# Altium schematic sheet AudioADCA.SchDoc
size A4
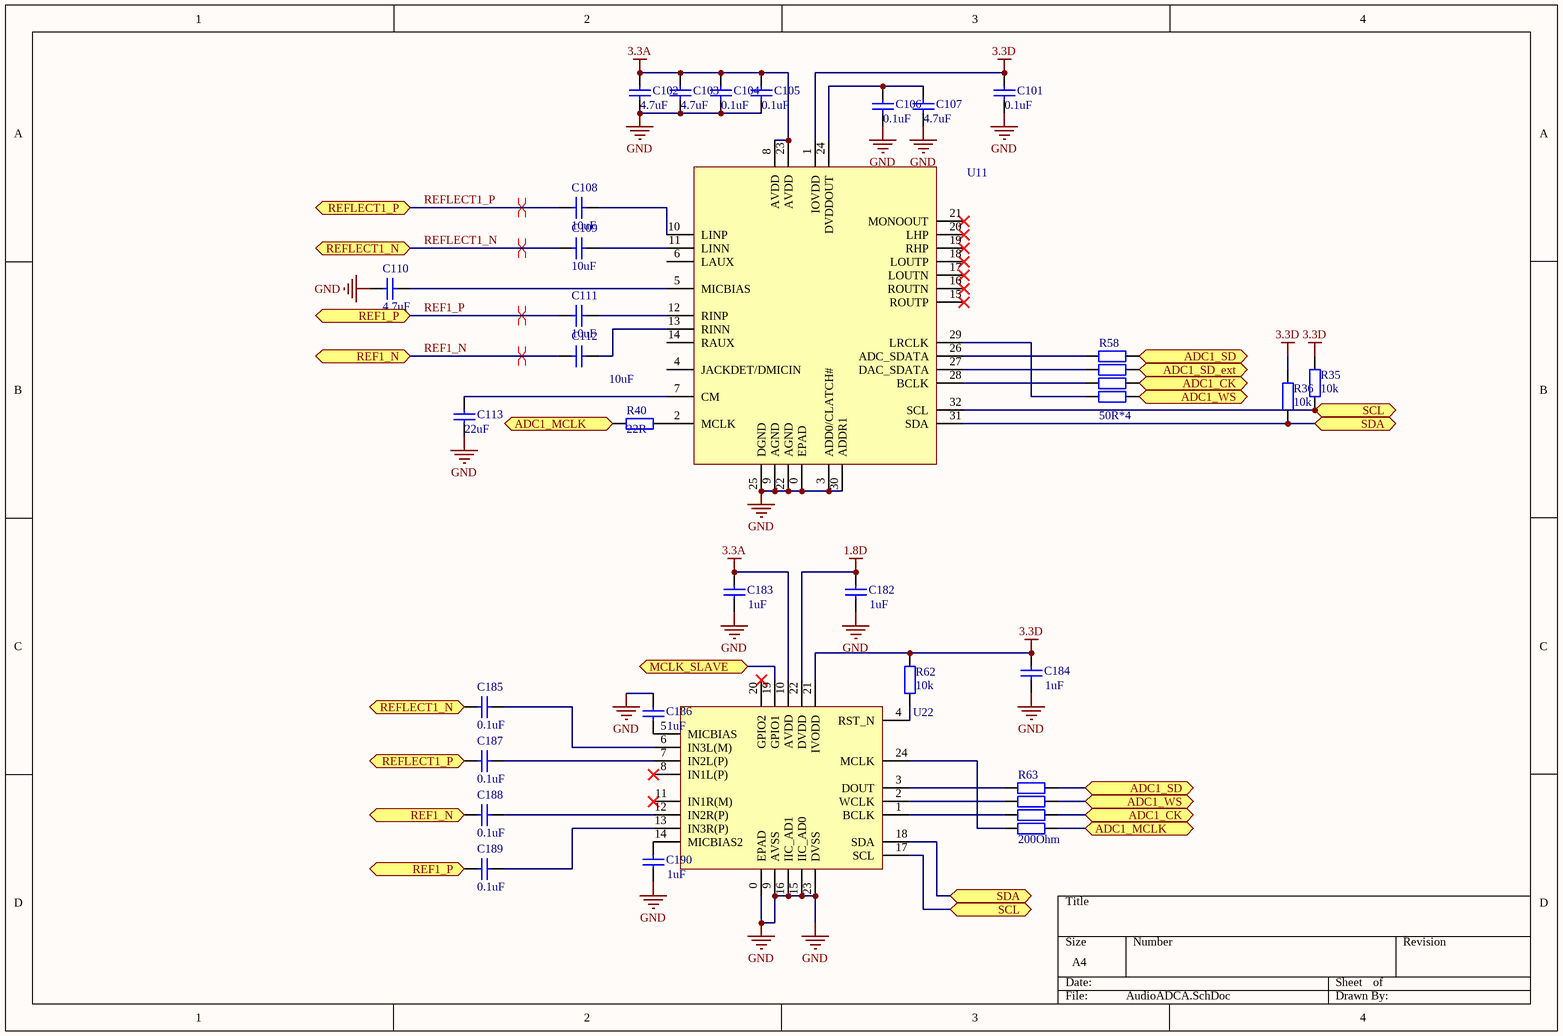
[diagram p0: AudioADCA.SchDoc]

## Parts
C101  0.1uF  [0402]
C102  4.7uF  [0805]
C103  4.7uF  [0805]
C104  0.1uF  [0402]
C105  0.1uF  [0402]
C106  0.1uF  [0402]
C107  4.7uF  [0805]
C108  10uF  [0402]
C109  10uF  [0402]
C110  4.7uF  [0402]
C111  10uF  [0402]
C112  10uF  [0402]
C113  22uF  [0805]
C182  1uF  [0402]
C183  1uF  [0402]
C184  1uF  [0402]
C185  0.1uF  [0402]
C186  1uF  [0402]
C187  0.1uF  [0402]
C188  0.1uF  [0402]
C189  0.1uF  [0402]
C190  1uF  [0402]
R35  value 10k  [0402]  (hidden comment: Res2)
R36  value 10k  [0402]  (hidden comment: Res2)
R40  22R  [0402]
R58  50R*4  [0402X4]
R62  value 10k  [0402]  (hidden comment: Res2)
R63  value 200Ohm  [0402X4]  (hidden comment: Res*4)
U11  ADAU1761  [ADAU1761]  (value not drawn)
U22  TLV320ADC3101  [TLV320ADC3101]  (value not drawn)

## Ports
ADC1_CK, ADC1_MCLK, ADC1_SD, ADC1_SD_ext, ADC1_WS, MCLK_SLAVE, REF1_N, REF1_P, REFLECT1_N, REFLECT1_P, SCL, SDA

## Nets
1.8D: C182.2 U22.22(DVDD)
3.3A: C102.2 C103.2 C104.2 C105.2 C183.2 U11.8(AVDD) U11.23(AVDD) U22.10(AVDD)
3.3D: C101.2 C184.2 R35.2 R36.2 R62.2 U11.1(IOVDD) U22.21(IVODD)
GND: C101.1 C102.1 C103.1 C104.1 C105.1 C106.1 C107.1 C110.1 C113.1 C182.1 C183.1 C184.1 C186.2 C190.1 U11.0(EPAD) U11.3(ADD0/CLATCH#) U11.9(AGND) U11.22(AGND) U11.25(DGND) U11.30(ADDR1) U22.0(EPAD) U22.9(AVSS) U22.15(IIC_AD0) U22.16(IIC_AD1) U22.23(DVSS)
ADC1_CK: R58.3 R63.6 ; port ADC1_CK
ADC1_MCLK: R40.2 R63.5 ; port ADC1_MCLK
ADC1_SD: R58.1 R63.8 ; port ADC1_SD
ADC1_SD_ext: R58.2 ; port ADC1_SD_ext
ADC1_WS: R58.4 R63.7 ; port ADC1_WS
MCLK_SLAVE: U22.19(GPIO1) ; port MCLK_SLAVE
REF1_N: C112.1 C188.2 ; port REF1_N
REF1_P: C111.1 C189.2 ; port REF1_P
REFLECT1_N: C109.2 C185.2 ; port REFLECT1_N
REFLECT1_P: C108.2 C187.2 ; port REFLECT1_P
SCL: R35.1 U11.32(SCL) U22.17(SCL) ; port SCL
SDA: R36.1 U11.31(SDA) U22.18(SDA) ; port SDA
NetC106_2: C106.2 C107.2 U11.24(DVDDOUT)
NetC108_1: C108.1 U11.10(LINP)
NetC109_1: C109.1 U11.11(LINN)
NetC110_2: C110.2 U11.5(MICBIAS)
NetC111_2: C111.2 U11.12(RINP)
NetC112_2: C112.2 U11.13(RINN)
NetC113_2: C113.2 U11.7(CM)
NetC185_1: C185.1 U22.6(IN3L(M))
NetC186_1: C186.1 U22.5(MICBIAS)
NetC187_1: C187.1 U22.7(IN2L(P))
NetC188_1: C188.1 U22.12(IN2R(P))
NetC189_1: C189.1 U22.13(IN3R(P))
NetC190_2: C190.2 U22.14(MICBIAS2)
NetR40_1: R40.1 U11.2(MCLK)
NetR58_5: R58.5 U11.29(LRCLK)
NetR58_6: R58.6 U11.28(BCLK)
NetR58_7: R58.7 U11.27(DAC_SDATA)
NetR58_8: R58.8 U11.26(ADC_SDATA)
NetR62_1: R62.1 U22.4(RST_N)
NetR63_1: R63.1 U22.3(DOUT)
NetR63_2: R63.2 U22.2(WCLK)
NetR63_3: R63.3 U22.1(BCLK)
NetR63_4: R63.4 U22.24(MCLK)

Not connected (* = marked no-connect by the designer): U11 4(JACKDET/DMICIN) 6(LAUX) 14(RAUX) 15(ROUTP)* 16(ROUTN)* 17(LOUTN)* 18(LOUTP)* 19(RHP)* 20(LHP)* 21(MONOOUT)*; U22 8(IN1L(P))* 11(IN1R(M))* 20(GPIO2)*

## Layout directives
differential pair: REF1_N, REF1_P, REFLECT1_N, REFLECT1_P

## Library data of the parts
C101-C113 C182-C190 = Cap: Capacitor
  C101-C113 C185 C187-C189: Published: 8-Jun-2000; LatestRevisionDate: 17-Jul-2002; LatestRevisionNote: Re-released for DXP Platform.; PackageReference: RAD-0.3; Publisher: Altium Limited; PackageDescription: Radial Cap, Thru-Hole; 2 Leads; 0.3 in Pin Spacing
R35 R36 R40 R62 = Res2: Resistor; Published: 8-Jun-2000; LatestRevisionDate: 17-Jul-2002; LatestRevisionNote: Re-released for DXP Platform.; PackageReference: AXIAL-0.4; Publisher: Altium Limited; PackageDescription: Axial Device, Thru-Hole; 2 Leads; 0.4 in Pin Spacing
R58 R63 = Res*4: Resistor; Published: 8-Jun-2000; LatestRevisionDate: 17-Jul-2002; LatestRevisionNote: Re-released for DXP Platform.; PackageReference: AXIAL-0.4; Publisher: Altium Limited; PackageDescription: Axial Device, Thru-Hole; 2 Leads; 0.4 in Pin Spacing